# Altium schematic sheet connectors.SchDoc
size A4; SheetNumber: 13; SheetTotal: 13
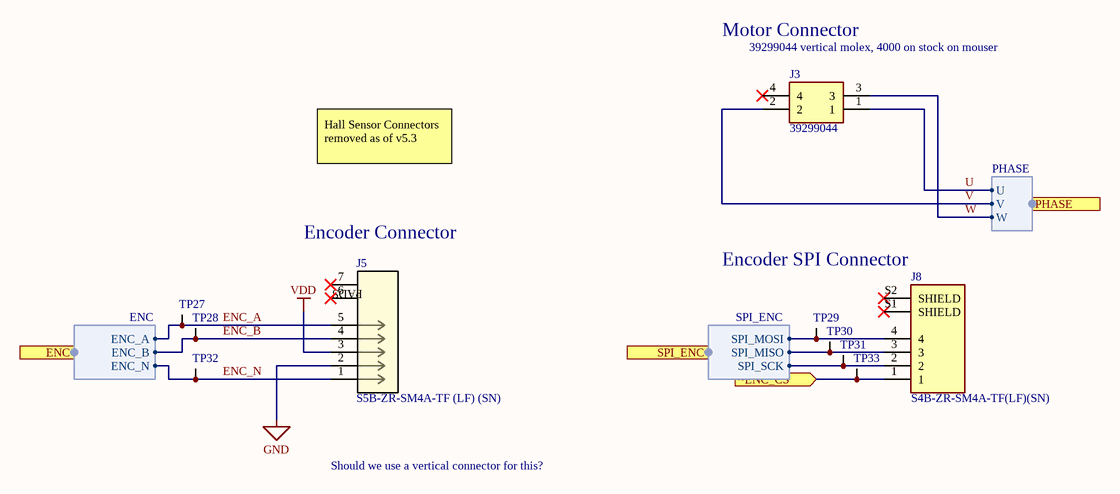
[diagram p0: connectors.SchDoc]

## Parts
J3  39299044  [39299044]
J5  S5B-ZR-SM4A-TF (LF) (SN)  [JST_S5B-ZR-SM4A-TF]
J8  S4B-ZR-SM4A-TF(LF)(SN)  [JST_S4B-ZR-SM4A-TF(LF)(SN)]
TP27  ENC_A  [TP]  (value not drawn)  (no BOM)
TP28  ENC_B  [TP]  (value not drawn)  (no BOM)
TP29  MOSI  [TP]  (value not drawn)  (no BOM)
TP30  MISO  [TP]  (value not drawn)  (no BOM)
TP31  SCK  [TP]  (value not drawn)  (no BOM)
TP32  ENC_N  [TP]  (value not drawn)  (no BOM)
TP33  ENC_CS  [TP]  (value not drawn)  (no BOM)

## Ports
ENC (harness ENC), PHASE (harness PHASE), SPI_ENC (harness SPI_ENC), ~ENC_CS (in)

## Harnesses
ENC: ENC_A, ENC_N, ENC_B
PHASE: U, V, W
SPI_ENC: SPI_SCK, SPI_MISO, SPI_MOSI

## Nets
GND: J5.2
VDD: J5.3
ENC_A: J5.5 TP27.1 ; port ENC.ENC_A
ENC_B: J5.4 TP28.1 ; port ENC.ENC_B
ENC_N: J5.1 TP32.1 ; port ENC.ENC_N
U: J3.1 ; port PHASE.U
V: J3.2 ; port PHASE.V
W: J3.3 ; port PHASE.W
~ENC_CS: J8.1 TP33.1 ; port ~ENC_CS
NetJ8_2: J8.2 TP31.1 ; port SPI_ENC.SPI_SCK
NetJ8_3: J8.3 TP30.1 ; port SPI_ENC.SPI_MISO
NetJ8_4: J8.4 TP29.1 ; port SPI_ENC.SPI_MOSI

Not connected (* = marked no-connect by the designer): J3 4*; J5 6* 7*; J8 S1(SHIELD)* S2(SHIELD)*

## Notes on the sheet
- Motor Connector
- (near J3) 39299044 vertical molex, 4000 on stock on mouser
- Hall Sensor Connectors removed as of v5.3
- (near J5) Encoder Connector
- (near J8) Encoder SPI Connector
- Should we use a vertical connector for this?
- (in symbol CN 5POS JST ZR RA) PADS

## Library data of the parts
J3 = CN HDR 4POS Molex 39299044 VERT: Molex 39299044 4POS Minifit / dual row, vertical; Supplier 1: Digi-Key; Supplier Part Number 1: WM7336-ND; Part Number: CN HDR 4POS Molex 39299044 VERT; Supplier URL 1: https://www.digikey.ca/en/products/detail/molex/0039299044/1624292?s=N4IgTCBcDaIOoFkDsBmFA2AtAOQCIgF0BfIA; Pin Count: 4; Manufacturer Part Number 1: 39299044
J5 = CN 5POS JST ZR RA: Connector Header Surface Mount, Right Angle 5 position 0.059" (1.50mm); Supplier 1: Digi-Key; Supplier Part Number 1: 455-1696-1-ND; Part Number: CN 5POS JST ZR RA; Supplier URL 1: https://www.digikey.ca/en/products/detail/jst-sales-america-inc/S5B-ZR-SM4A-TF-LF-SN/926603?s=N4IgTCBcDaICwFYEFoCMA2AnOtyByAIiALoC%2BQA; Pin Count: 5; Manufacturer Part Number 1: S5B-ZR-SM4A-TF
J8 = CN 4POS JST ZR RA: Connector Header Surface Mount, Right Angle 4 position 0.059 (1.50mm); MF: JST Sales; SnapEDA_Link: https://www.snapeda.com/parts/S4B-ZR-SM4A-TF(LF)(SN)/JST%20Sales%20America%20Inc./view-part/449060/?ref=snap; Availability: Unavailable; Value: *; Price: None; Arrow_Electronics-Purchase-URL: https://snapeda.com/shop?store=Arrow+Electronics&id=449060; MP: S4B-ZR-SM4A-TF(LF)(SN); Package: None; Part Number: CN 4POS JST ZR RA; Supplier 1: Digi-Key; Supplier Part Number 1: 455-1695-1-ND; Supplier URL 1: https://www.digikey.ca/en/products/detail/jst-sales-america-inc/S4B-ZR-SM4A-TF-LF-SN/926602?s=N4IgTCBcDaIMoBYBCBaAWgJRXAsgggigCoBiAFADIkCUZcActSALoC%2BQA; Pin Count: 4
TP27-TP33 = Test Point (Via): Part Number: Test Point (Via)